# Altium schematic sheet LPGDetA1_out.SchDoc
size A4; DocumentNumber: 5; SheetNumber: 5; SheetTotal: 6; Subtitle0: Zrodlo pradowe w ukladzie Howlanda; LotOfPieces: 1
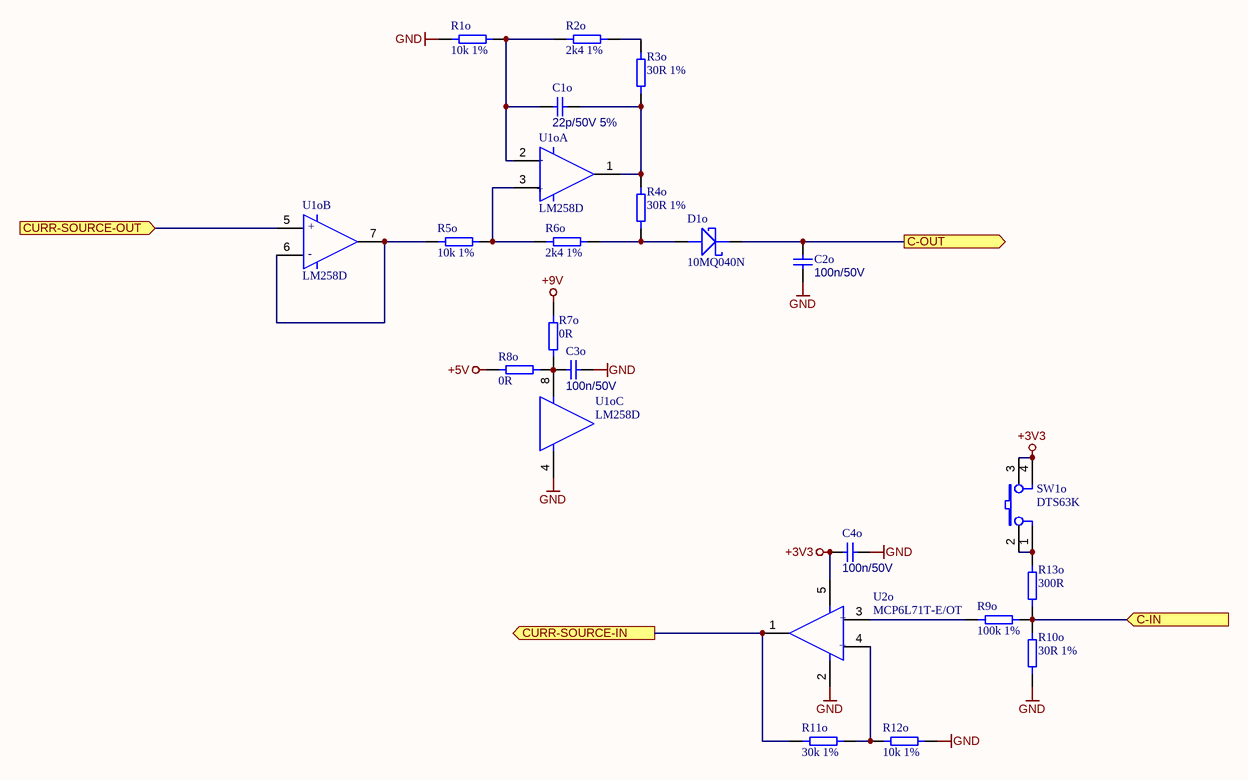
[diagram p0: LPGDetA1_out.SchDoc]

## Parts
?  (no value)
C1o  OtherParams: 22p/50V 5%  [0805]  (hidden comment: CL21C220JBANNNC)
C2o  OtherParams: 100n/50V  [1206_0805]  (hidden comment: CL21B104KBCNNNC)
C3o  OtherParams: 100n/50V  [1206_0805]  (hidden comment: CL21B104KBCNNNC)
C4o  OtherParams: 100n/50V  [1206_0805]  (hidden comment: CL21B104KBCNNNC)
D1o  10MQ040N  [SMA]
R1o  OtherParams: 10k 1%  [0805]  (hidden comment: 0805WAF10KT5E)
R2o  OtherParams: 2k4 1%  [0805]  (hidden comment: 0805WAF 2K4 T5E)
R3o  OtherParams: 30R 1%  [0805]  (hidden comment: 0805WAF 30R T5E)
R4o  OtherParams: 30R 1%  [0805]  (hidden comment: 0805WAF 30R T5E)
R5o  OtherParams: 10k 1%  [0805]  (hidden comment: 0805WAF10KT5E)
R6o  OtherParams: 2k4 1%  [0805]  (hidden comment: 0805WAF 2K4 T5E)
R7o  OtherParams: 0R  [1206_0805]  (hidden comment: 0805WAJ 0R T5E)
R8o  OtherParams: 0R  [1206_0805]  (hidden comment: 0805WAJ 0R T5E)
R9o  OtherParams: 100k 1%  [0805]  (hidden comment: 0805WAF 100K T5E)
R10o  OtherParams: 30R 1%  [0805]  (hidden comment: 0805WAF 30R T5E)
R11o  OtherParams: 30k 1%  [0805]  (hidden comment: 0805WAF 30K T5E)
R12o  OtherParams: 10k 1%  [0805]  (hidden comment: 0805WAF10KT5E)
R13o  OtherParams: 300R  [0805]  (hidden comment: 0805WAJ 300R T5E)
SW1o  DTS63K  [DTS63K]
U1o  LM258D  [8SOIC150]  (parts A,B,C of 3)
U2o  MCP6L71T-E/OT  [SOT23-5]

## Ports
C-IN, C-OUT, CURR-SOURCE-IN, CURR-SOURCE-OUT

## Nets
+3V3: C4o.1 SW1o.3 SW1o.4 U2o.5(PLUS_V)
+5V: R8o.1
+9V: R7o.2
GND: C2o.1 C3o.2 C4o.2 R1o.2 R10o.2 R12o.2 U1o.4(MINUS_V) U2o.2(MINUS_V)
C-IN: R9o.2 R10o.1 R13o.2 ; port C-IN
C-OUT: C2o.2 D1o.CATH ; port C-OUT
CURR-SOURCE-IN: R11o.1 U2o.1(OUTPUT) ; port CURR-SOURCE-IN
CURR-SOURCE-OUT: U1o.5(PLUS_INPUT) ; port CURR-SOURCE-OUT
NetC1o_1: C1o.1 R1o.1 R2o.1 U1o.2(MINUS_INPUT)
NetC1o_2: C1o.2 R3o.1 R4o.2 U1o.1(OUTPUT)
NetC3o_1: C3o.1 R7o.1 R8o.2 U1o.8(PLUS_V)
NetD1o_ANOD: D1o.ANOD R4o.1 R6o.2
NetR2o_2: R2o.2 R3o.2
NetR5o_1: R5o.1 R6o.1 U1o.3(PLUS_INPUT)
NetR5o_2: R5o.2 U1o.6(MINUS_INPUT) U1o.7(OUTPUT)
NetR9o_1: R9o.1 U2o.3(PLUS_INPUT)
NetR11o_2: R11o.2 R12o.1 U2o.4(MINUS_INPUT)
NetR13o_1: R13o.1 SW1o.1 SW1o.2

## Notes on the sheet
- K.A.
- echnology
- Wariant:
- Projekt i wykonanie: Miroslaw Lach MRQ, www.mrq-ml.com
- "AMPROJECT" Andrzej Maciejak
- SVNPath:
- Page:
- Rev.
- /
- File name:
- (in symbol LM258D[[/\]]8SOIC150, part A) -; +
- (in symbol LM258D[[/\]]8SOIC150, part B) +; -
- (in symbol MCP6L71T-E/OT[[/\]]SOT23-5) +; _

## Library data of the parts
? = KATECHNOLOGYLOGO
C1o = CL21C220JBANNNC[[/\]]0805[[/\]]50V[[/\]]5%[[/\]]22p/50V 5%: MaxVoltage: 50V; Tolerance: 5%; Descript: capacitor 22pF, 50V, COG 5%; Currency5: PLN; Amount5: 100+; Value: CL21C220JBANNNC; Dimensions: 0805; ComponentLink1Description: Datasheet; ComponentLink1URL: http://www.mrq-ml.com/Parts/Capacitors/mlcc_samsung.pdf; Supplier5: tme.pl; Reference5: CL21C220JBANNNC; Manufacturer5: Samsung; Typ5: CL21C220JBANNNC; Price5: 0,029; DateOfPrice5: 2012-09-19; Price1: 0,018
C2o C3o C4o = CL21B104KBCNNNC[[/\]]0805[[/\]]50V[[/\]]10%[[/\]]100n/50V: MaxVoltage: 50V; Tolerance: 10%; Descript: capacitor 100nF/50V, 0805, X7R, 10%; Currency5: PLN; Amount5: 100+; Value: CL21B104KBCNNNC; Dimensions: 0805; ComponentLink1Description: Datasheet; ComponentLink1URL: http://www.mrq-ml.com/Parts/Capacitors/mlcc_samsung.pdf; Supplier5: tme.pl; Reference5: CL21B104KBCNNNC; Manufacturer5: Samsung; Typ5: CL21B104KBCNNNC; Price5: 0,025; DateOfPrice5: 2013-01-03; Price1: 0,019
D1o = 10MQ040N[[/\]]SMA: Descript: Diode type:Schottky; Voltage, Vrrm:40V; Current, If av:1.5A; Voltage, Vf max:0.62V; Case style:SMA; Typ5: 10MQ040NTRPBF; Currency5: PLN; Amount5: 5+; Value: 10MQ040N; Dimensions: SMA; ComponentLink1Description: Datasheet; ComponentLink1URL: http://mrq-ml.com/Parts/Diodes/10mq040n.pdf; Supplier5: tme.pl; Reference5: 10MQ040N; Manufacturer5: Vishay; Price5: 0,5; DateOfPrice5: 2012-11-24; Price1: 0,425
R1o R5o R12o = 0805WAF10KT5E[[/\]]0805[[/\]]0.125W[[/\]]1%[[/\]]10k 1%: DissPower: 0.125W; Tolerance: 1%; Descript: Resistor 10kohm, 0805, 1%; Reference5: SMD0805-10K-1%; Currency5: PLN; Amount5: 100+; Value: 0805WAF10KT5E; Dimensions: 0805; ComponentLink1Description: Datasheet; ComponentLink1URL: http://www.mrq-ml.com/Parts/Resistors/RoyalOhm_rezystor-smd.pdf; Supplier5: tme.pl; Manufacturer5: Royal Ohm; Typ5: 0805WAF 10K T5E; Price5: 0,029; DateOfPrice5: 2013-01-03; Price1: 0,018
R2o R6o = 0805WAF 2K4 T5E[[/\]]0805[[/\]]0.125W[[/\]]1%[[/\]]2k4 1%: DissPower: 0.125W; Tolerance: 1%; Descript: Resistor 2.4kohm, 1%, 0.125W, 0805; Reference5: SMD0805-2K4-1%; Currency5: PLN; Amount5: 100+; Value: 0805WAF 2K4 T5E; Dimensions: 0805; ComponentLink1Description: Datasheet; ComponentLink1URL: http://www.mrq-ml.com/Parts/Resistors/RoyalOhm_rezystor-smd.pdf; Supplier5: tme.pl; Manufacturer5: Royal Ohm; Typ5: 0805WAF 2K4 T5E; Price5: 0,029; DateOfPrice5: 2012-11-24; Price1: 0,029
R3o R4o R10o = 0805WAF 30R T5E[[/\]]0805[[/\]]0.125W[[/\]]1%[[/\]]30R 1%: DissPower: 0.125W; Tolerance: 1%; Descript: Resistor 30ohm, 0805, 1%; Reference5: SMD0805-30R-1%; Currency5: PLN; Amount5: 100+; Value: 0805WAF 30R T5E; Dimensions: 0805; ComponentLink1Description: Datasheet; ComponentLink1URL: http://www.mrq-ml.com/Parts/Resistors/RoyalOhm_rezystor-smd.pdf; Supplier5: tme.pl; Manufacturer5: Royal Ohm; Typ5: 0805WAF 30R T5E; Price5: 0,029; DateOfPrice5: 2012-11-24; Price1: 0,029
R7o R8o = 0805WAJ 0R T5E[[/\]]0805[[/\]]0.125W[[/\]]0.1R[[/\]]0R: DissPower: 0.125W; Tolerance: 0.1R; Descript: Resistor 0 ohm, SMD, 0805; Reference5: SMD0805-0R; Currency5: PLN; Amount5: 100+; Value: 0805WAJ 0R T5E; Dimensions: 0805; ComponentLink1Description: Datasheet; ComponentLink1URL: http://www.mrq-ml.com/Parts/Resistors/RoyalOhm_rezystor-smd.pdf; Supplier5: tme.pl; Manufacturer5: Royal Ohm; Typ5: 0805WAJ 0R T5E; Price5: 0,025; DateOfPrice5: 2012-11-24; Price1: 0,025
R9o = 0805WAF 100K T5E[[/\]]0805[[/\]]0.125W[[/\]]1%[[/\]]100k 1%: DissPower: 0.125W; Tolerance: 1%; Descript: Resistor 100kohm, 0805, 1%; Reference5: SMD0805-100K-1%; Currency5: PLN; Amount5: 100+; Value: 0805WAF 100K T5E; Dimensions: 0805; ComponentLink1Description: Datasheet; ComponentLink1URL: http://www.mrq-ml.com/Parts/Resistors/RoyalOhm_rezystor-smd.pdf; Supplier5: tme.pl; Manufacturer5: Royal Ohm; Typ5: 0805WAF 100K T5E; Price5: 0,029; DateOfPrice5: 2012-09-20; Price1: 0,017
R11o = 0805WAF 30K T5E[[/\]]0805[[/\]]0.125W[[/\]]1%[[/\]]30k 1%: DissPower: 0.125W; Tolerance: 1%; Descript: Resistor 30kohm, 0805, 1%; Reference5: SMD0805-30K-1%; Currency5: PLN; Amount5: 100+; Value: 0805WAF 30K T5E; Dimensions: 0805; ComponentLink1Description: Datasheet; ComponentLink1URL: http://www.mrq-ml.com/Parts/Resistors/RoyalOhm_rezystor-smd.pdf; Supplier5: tme.pl; Manufacturer5: Royal Ohm; Typ5: 0805WAF 30K T5E; Price5: 0,029; DateOfPrice5: 2012-11-24; Price1: 0,029
R13o = 0805WAJ 300R T5E[[/\]]0805[[/\]]0.125W[[/\]]5%[[/\]]300R: DissPower: 0.125W; Tolerance: 5%; Descript: Rezystor:thick film; SMD; 0805; 300R; 0,125W; ±5%; -55÷125°C; Reference5: SMD0805-300R; Currency5: PLN; Amount5: 100+; Value: 0805WAJ 300R T5E; Dimensions: 0805; ComponentLink1Description: Datasheet; ComponentLink1URL: http://www.mrq-ml.com/Parts/Resistors/RoyalOhm_rezystor-smd.pdf; Supplier5: tme.pl; Manufacturer5: Royal Ohm; Typ5: 0805WAJ 300R T5E; Price5: 0,025; DateOfPrice5: 2012-09-18; Price1: 0,01
SW1o = DTS63K[[/\]]DTS63K[[/\]]6x6: Descript: tactile switch; Typ5: DTS-63K; Currency5: PLN; Amount5: 5+; Value: DTS63K; OtherParams: DTS63K; Dimensions: 6x6; ComponentLink1Description: Datasheet; ComponentLink1URL: http://www.mrq-ml.com/Parts/Electromechanical/DTSxA62x6xx644.pdf; Supplier5: tme.pl; Reference5: DTS63K; Manufacturer5: Diptronics; Price5: 0,5655; DateOfPrice5: 2012-09-21
U1o = LM258D[[/\]]8SOIC150: Descript: Low Power Dual Operational Amplifiers; Reference5: LM258DSMD; Currency5: PLN; Amount5: 10+; Value: LM258D; Dimensions: 8SOIC150; ComponentLink1Description: Datasheet; ComponentLink1URL: http://www.mrq-ml.com/Parts/ICs/LM158.pdf; Supplier5: tme.pl; Price5: 0,397; DateOfPrice5: 2012-11-16; Price1: 0,305; Manufacturer5: Texas Instruments; Typ5: LM258D
U2o = MCP6L71T-E/OT[[/\]]SOT23-5: Descript: 2MHz, 85uA, OpAmp, SOT23-5; Reference5: 1715861; Currency5: PLN; Amount5: 1+; Value: MCP6L71T-E/OT; Price1: 1,33; Dimensions: SOT23-5; ComponentLink1Description: Datasheet; ComponentLink1URL: http://www.mrq-ml.com/Parts/ICs/MCP6L71.pdf; Supplier5: farnell.com; Manufacturer5: Microchip; Typ5: MCP6L71T-E/OT; Price5: 1,86; DateOfPrice5: 2012-11-03